# EAGLE schematic PCB-JOY-4AXIS (EAGLE 7.7.0)
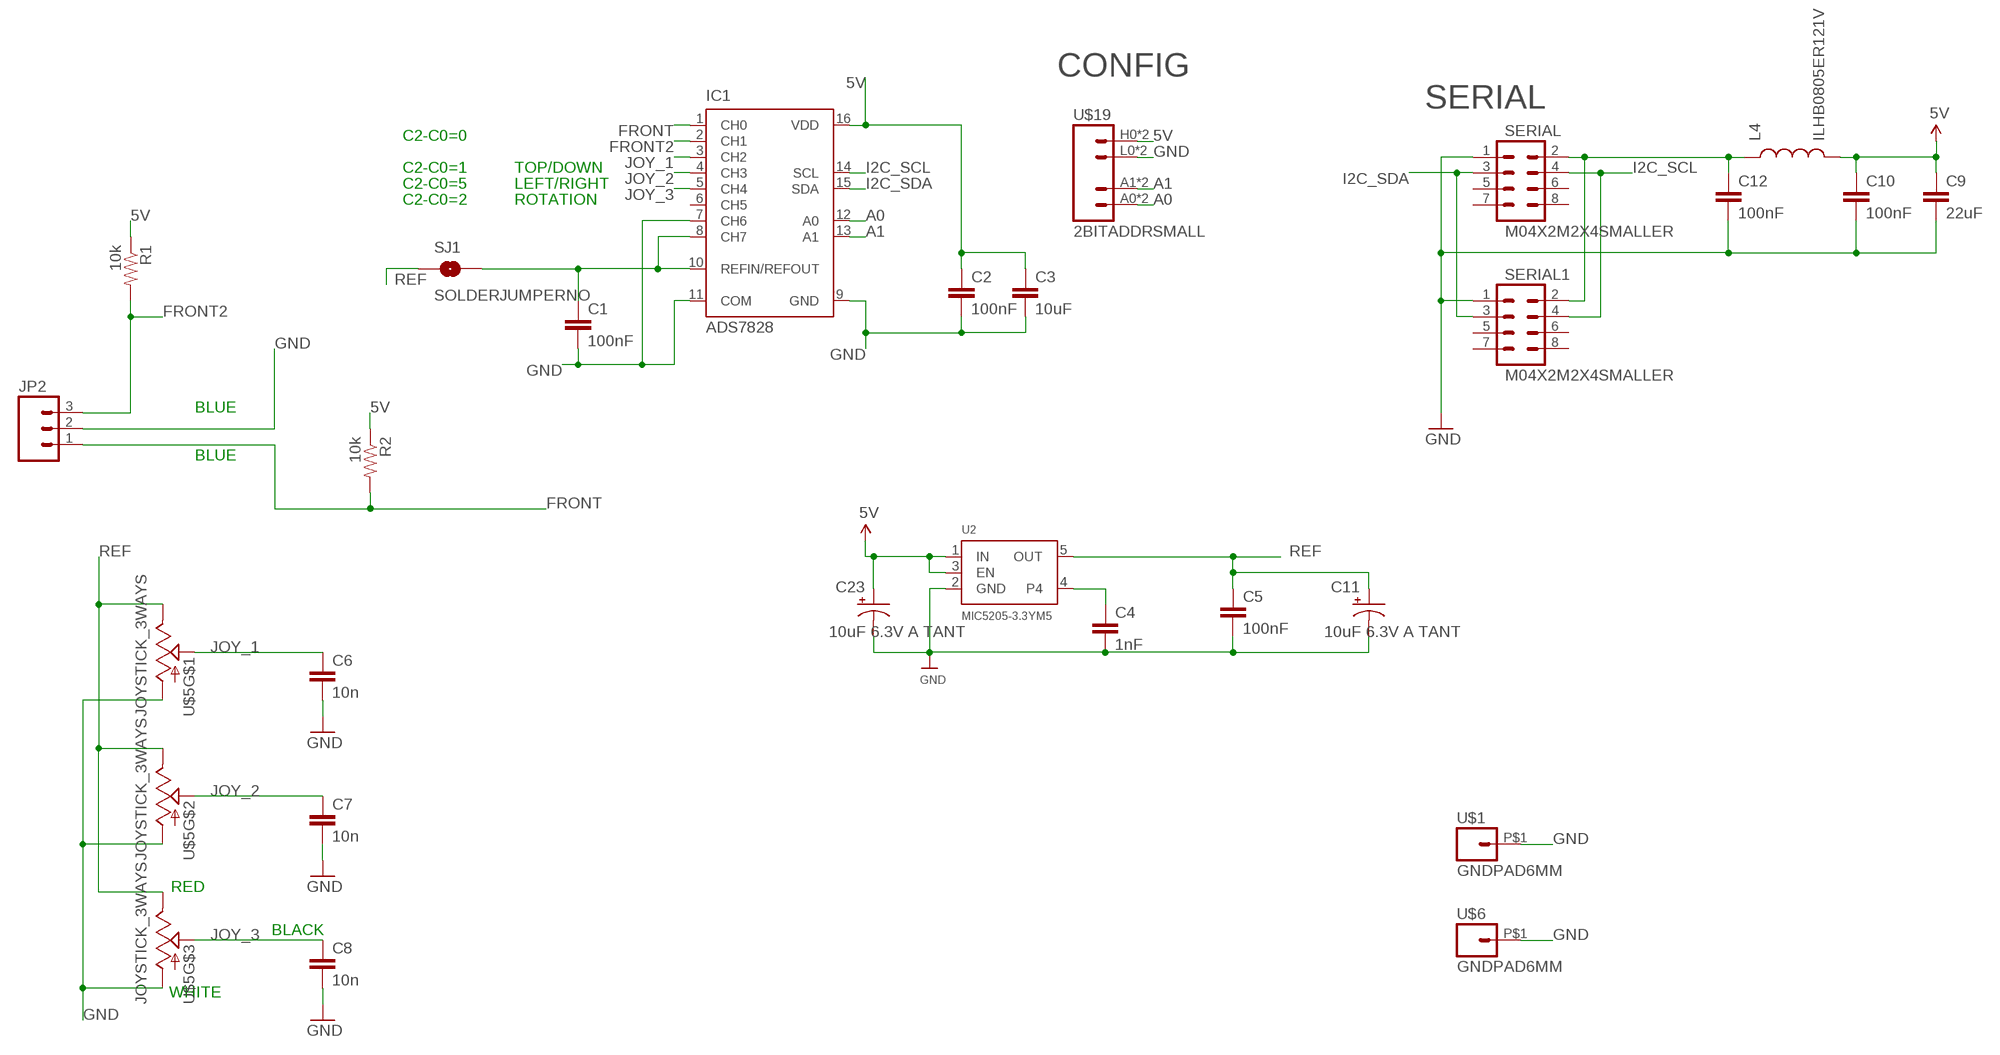
[diagram p0: schematic, sheet 1]

## Parts
C1  100nF  CAP0603-CAP  [0603-CAP]
C2  100nF  CAP0603-CAP  [0603-CAP]
C3  10uF  CAP0805  [0805]
C4  1nF  CAP0603-CAP  [0603-CAP]
C5  100nF  CAP0603-CAP  [0603-CAP]
C6  10n  CAP0603-CAP  [0603-CAP]
C7  10n  CAP0603-CAP  [0603-CAP]
C8  10n  CAP0603-CAP  [0603-CAP]
C9  22uF  CAP0805  [0805]
C10  100nF  CAP0603-CAP  [0603-CAP]
C11  10uF 6.3V A TANT  CAP_POL1206  [EIA3216]
C12  100nF  CAP0603-CAP  [0603-CAP]
C23  10uF 6.3V A TANT  CAP_POL1206  [EIA3216]
IC1  ADS7828  [TSSOP16-PW]
JP2  M03PTH  [1X03]
L4  ILHB0805ER121V  INDUCTOR0805  [0805]
R1  10k  RESISTOR0603-RES  [0603-RES]
R2  10k  RESISTOR0603-RES  [0603-RES]
SERIAL  M04X2M2X4SMALLER  [M2X4SMALLER]
SERIAL1  M04X2M2X4SMALLER  [M2X4SMALLER]
SJ1  SOLDERJUMPERNO  [SJ_2S-NO]
U2  MIC5205-3.3YM5  VREG_SOT23-5  [SOT23-5]
U$1  GNDPAD6MM  [3.2MMPAD6MM]
U$5  JOYSTICK_3WAYS  [JOYSTICK]
U$6  GNDPAD6MM  [3.2MMPAD6MM]
U$19  2BITADDRSMALL  [2BITADDR_SMALL]

## Nets
5V [Power]: C2.1 C3.1 C9.1 C10.1 C23.A(+) IC1.16(VDD) L4.2 R1.1 R2.1 U2.1(IN) U2.3(EN) U$19.H0(VCC) U$19.H1(VCC)
5V_AD [Power]: C1.1 IC1.8(CH7) IC1.10(REFIN/REFOUT) SJ1.2
A0: IC1.12(A0) U$19.A0(A1) U$19.AS0(A1)
A1: IC1.13(A1) U$19.A1(A2) U$19.AS1(A2)
ARD_5V [Power]: C12.1 L4.1 SERIAL1.2 SERIAL.2
FRONT: IC1.1(CH0) JP2.1 R2.2
FRONT2: IC1.2(CH1) JP2.3 R1.2
GND [Power]: C1.2 C2.2 C3.2 C4.2 C5.2 C6.2 C7.2 C8.2 C9.2 C10.2 C11.C(-) C12.2 C23.C(-) IC1.7(CH6) IC1.9(GND) IC1.11(COM) JP2.2 SERIAL1.1 SERIAL.1 U2.2(GND) U$1.P$1 U$5.LR_COM(A) U$5.ROT_COM(A) U$5.UD_COM(A) U$6.P$1 U$19.L0(GND) U$19.L1(GND)
I2C_SCL: IC1.14(SCL) SERIAL1.4 SERIAL.4
I2C_SDA: IC1.15(SDA) SERIAL1.3 SERIAL.3
JOY_1: C6.1 IC1.3(CH2) U$5.LR_C(S)
JOY_2: C7.1 IC1.4(CH3) U$5.UD_C(S)
JOY_3: C8.1 IC1.5(CH4) U$5.ROT_C(S)
N$1: C4.1 U2.4
REF [Power]: C5.1 C11.A(+) SJ1.1 U2.5(OUT) U$5.LR_V(E) U$5.ROT_V(E) U$5.UD_V(E)
Unconnected: IC1.6(CH5) SERIAL1.5 SERIAL1.6 SERIAL1.7 SERIAL1.8 SERIAL.5 SERIAL.6 SERIAL.7 SERIAL.8

## Notes on the sheet
- CONFIG
- SERIAL
- C2-C0=0
- C2-C0=1 | TOP/DOWN
- C2-C0=5 | LEFT/RIGHT
- C2-C0=2 | ROTATION
- BLUE
- BLUE
- RED
- BLACK
- WHITE

## Library data of the parts
C1-C10 = SparkFun:CAP: Capacitor Standard 0603 ceramic capacitor, and 0.1" leaded capacitor.
C11 C23 = freetronics:CAP_POL: Capacitor Polarized These are standard SMD and PTH capacitors. Normally 10uF, 47uF, and 100uF in electrolytic and tantalum varieties. Always verify the external diameter of the through hole cap, it varies with capacity, voltage, and manufacturer. The EIA devices should be standard.
C12 = SparkFun:CAP: Capacitor Standard 0603 ceramic capacitor, and 0.1" leaded capacitor.; TEST2: testt2
IC1 = burr-brown:ADS7828: 12-Bit, 8-Channel Sampling ANALOG-TO-DIGITAL CONVERTER with I2C? Interface Source: www.ti.com .. ADS7828.pdf; MF: TEXAS INSTRUMENTS; MPN: ADS7828E/250; OC_FARNELL: 1470338; OC_NEWARK: 74C7158
JP2 = SparkFun:M03: Header 3 Standard 3-pin 0.1" header. Use with straight break away headers (SKU : PRT-00116), right angle break away headers (PRT-00553), swiss pins (PRT-00743), machine pins (PRT-00117), and female headers (PRT-00115). Molex polarized connector foot print use with SKU : PRT-08232 with associated crimp pins and housings.
L4 = SparkFun:INDUCTOR: Inductors Basic Inductor/Choke - 0603 and 1206. Footprints are not proven and vary greatly between part numbers.
R1 R2 = SparkFun:RESISTOR: Resistor Basic schematic elements and footprints for 0603, 1206, and PTH resistors.
SERIAL SERIAL1 = SKAARHOJ:M04X2
SJ1 = SparkFun:SOLDERJUMPER: Solder Jumper Standard SMD solder jumper. Used to automate production. Two varients : Normally Open and Normally Closed are the same, but have different paste layers. NC will have a large amount of paste and should jumper during reflow.
U2 = microbuilder:VREG_SOT23-5: SOT23-5 Fixed Voltage Regulators To better organise some of the SOT23-5 fixed voltage regulators in this library, this new part was created. Part Current Out V Out V In V Dropout Digikey Part No. ADP121 150mA 3.3V 3.4-5.5V 0.09V @ 150mA ADP121-AUJZ33R7CT-ND ADP121 150mA 3.0V 3.1-5.5V 0.09V @ 150mA ADP121-AUJZ30R7CT-ND ADP122 300mA 3.3V 3.4-5.5V 0.085V @ 300mA ADP122AUJZ-3.3-R7CT-ND ADP1712 300mA 3.3V 3.5-5.5V 0.17V @ 300mA ADP1712AUJZ-3.3-R7TR-ND AP7311 (Low Cost) 150mA 3.3V 3.5-6V 0.15V @ 150mA AP7311-33WG-7DICT-ND LD39015M18R 150mA 1.8V 1.9V-5.5V 0.08V @ 100mA 497-6977-1-ND MCP1824T-3302E/OT 300mA 3.3V 3.5V-6V 0.2V @ 300mA MCP1824T-3302E/OTCT-ND MIC5205-2.5YM5 TR 150mA 2.5V 2.7-16V 0.165V @ 150mA 576-1257-2-ND MIC5205-3.0YM5 TR 150mA 3.0V 3.2V-16V 0.165V @ 150mA 576-1258-2-ND MIC5205-3.3YM5 TR 150mA 3.3V 3.5V-16V 0.165V @ 150mA 576-1259-2-ND TPS780330220 150mA 3.3V+2.2V 3.6-5.5V 250mV Max 296-23332-1-ND TDA3663/N1,135 100mA 3.3V 3.5-45V 0.18V @ 50mA 568-5343-1-ND
U$1 U$6 = SKAARHOJ:GNDPAD
U$5 = SKAARHOJ:JOYSTICK_3WAYS
U$19 = SKAARHOJ:2BITADDR

## Net classes
0 default: width 0.203 mm, drill 0.406 mm, clearance 0.203 mm
1 Power: width 0.305 mm, drill 0.61 mm, clearance 0.203 mm